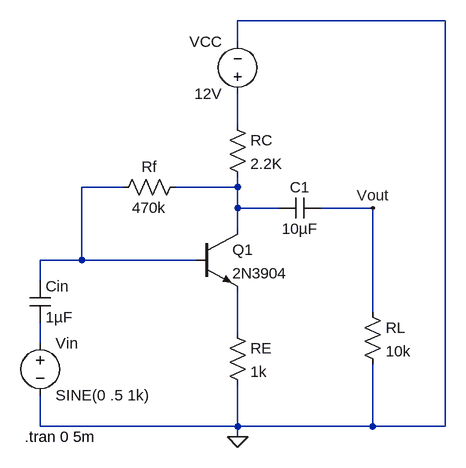
[diagram p0: schematic Draft1.asc]
Draft1.asc, the LTspice schematic file:
Version 4.1
SHEET 1 920 680
WIRE 496 -240 176 -240
WIRE 176 -208 176 -240
WIRE 176 -80 176 -128
WIRE 0 16 -64 16
WIRE 176 16 176 0
WIRE 176 16 80 16
WIRE 176 48 176 16
WIRE 240 48 176 48
WIRE 384 48 304 48
WIRE 176 80 176 48
WIRE -64 128 -64 16
WIRE -64 128 -128 128
WIRE 112 128 -64 128
WIRE -128 160 -128 128
WIRE 384 208 384 48
WIRE 176 240 176 176
WIRE -128 256 -128 224
WIRE -128 384 -128 336
WIRE 176 384 176 320
WIRE 176 384 -128 384
WIRE 384 384 384 288
WIRE 384 384 176 384
WIRE 496 384 496 -240
WIRE 496 384 384 384
WIRE 176 400 176 384
FLAG 176 400 0
FLAG 384 48 Vout
SYMBOL npn 112 80 R0
SYMATTR InstName Q1
SYMATTR Value 2N3904
SYMBOL res 160 -96 R0
SYMATTR InstName RC
SYMATTR Value 2.2K
SYMATTR SpiceLine tol=1 pwr=0.1
SYMBOL res 160 224 R0
SYMATTR InstName RE
SYMATTR Value 1k
SYMATTR SpiceLine tol=1 pwr=0.1
SYMBOL cap -144 160 R0
SYMATTR InstName Cin
SYMATTR Value 1µF
SYMBOL voltage -128 240 R0
WINDOW 123 0 0 Left 0
WINDOW 39 0 0 Left 0
SYMATTR InstName Vin
SYMATTR Value SINE(0 .5 1k)
SYMBOL res 96 0 R90
WINDOW 0 0 56 VBottom 2
WINDOW 3 32 56 VTop 2
SYMATTR InstName Rf
SYMATTR Value 470k
SYMBOL voltage 176 -112 R180
WINDOW 0 24 96 Left 2
WINDOW 3 24 16 Left 2
SYMATTR InstName VCC
SYMATTR Value 12V
SYMBOL cap 240 64 R270
WINDOW 0 32 32 VTop 2
WINDOW 3 0 32 VBottom 2
SYMATTR InstName C1
SYMATTR Value 10µF
SYMBOL res 368 192 R0
SYMATTR InstName RL
SYMATTR Value 10k
TEXT -152 400 Left 2 !.tran 0 5m

The netlist it stands for:
* Draft1.asc
Q1 N003 N002 N004 0 2N3904
RC N001 N003 2.2K tol=1 pwr=0.1
RE N004 0 1k tol=1 pwr=0.1
Cin N002 N005 1µF
Vin N005 0 SINE(0 .5 1k)
Rf N003 N002 470k
VCC N001 0 12V
C1 N003 Vout 10µF
RL Vout 0 10k
.model NPN NPN
.model PNP PNP
.lib standard.bjt
.tran 0 5m
.backanno
.end